# Altium schematic sheet Level_Shifters.SchDoc: Audio Research: Level Shifters
size A4; DrawnBy: Connor Dack; Engineer: Connor Dack; DocumentNumber: 6; Revision: 1.0; SheetNumber: 6; SheetTotal: 20
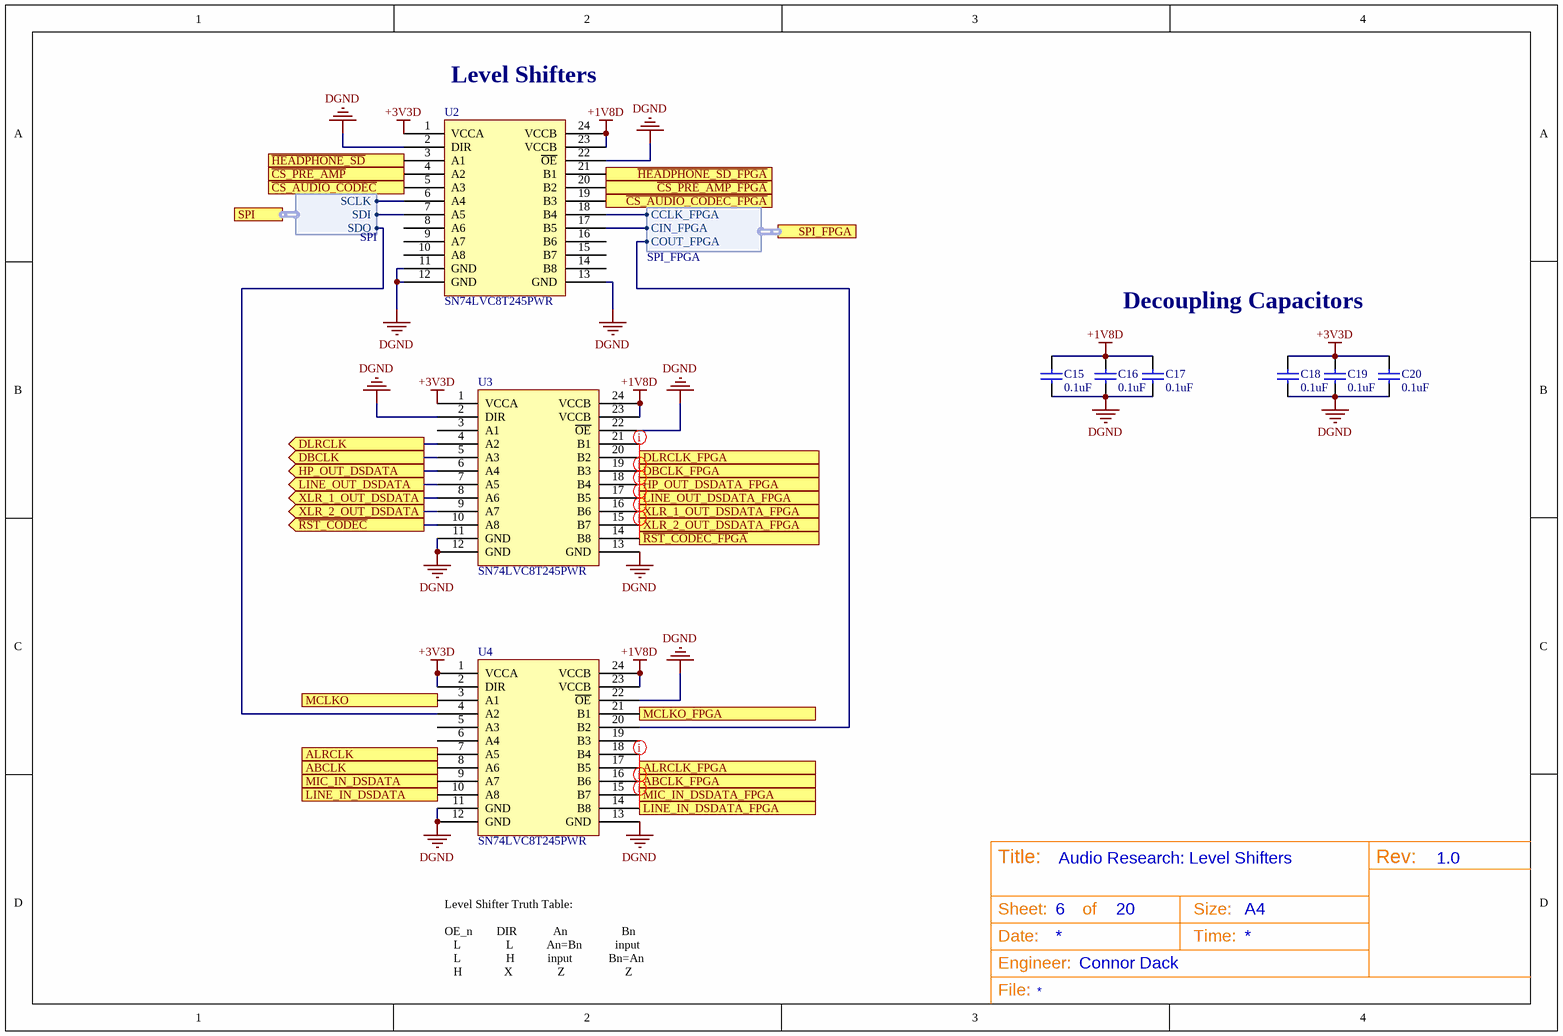
[diagram p0: Level_Shifters.SchDoc]

## Parts
C15  Capacitance: 0.1uF  [3-0603_L]  (hidden comment: CL10F104ZO8NNNC)
C16  Capacitance: 0.1uF  [3-0603_L]  (hidden comment: CL10F104ZO8NNNC)
C17  Capacitance: 0.1uF  [3-0603_L]  (hidden comment: CL10F104ZO8NNNC)
C18  Capacitance: 0.1uF  [3-0603_L]  (hidden comment: CL10F104ZO8NNNC)
C19  Capacitance: 0.1uF  [3-0603_L]  (hidden comment: CL10F104ZO8NNNC)
C20  Capacitance: 0.1uF  [3-0603_L]  (hidden comment: CL10F104ZO8NNNC)
U2  IC BUS TRANSCVR 8BIT 24TSSOP  [TSOP65P640X120-24N]  (value not drawn)
U3  IC BUS TRANSCVR 8BIT 24TSSOP  [TSOP65P640X120-24N]  (value not drawn)
U4  IC BUS TRANSCVR 8BIT 24TSSOP  [TSOP65P640X120-24N]  (value not drawn)

## Ports
ABCLK (in), ABCLK_FPGA (out), ALRCLK (in), ALRCLK_FPGA (out), DBCLK (out), DBCLK_FPGA (in), DLRCLK (out), DLRCLK_FPGA (in), HP_OUT_DSDATA (out), HP_OUT_DSDATA_FPGA (in), LINE_IN_DSDATA (in), LINE_IN_DSDATA_FPGA (out), LINE_OUT_DSDATA (out), LINE_OUT_DSDATA_FPGA (in), MCLKO (in), MCLKO_FPGA (out), MIC_IN_DSDATA (in), MIC_IN_DSDATA_FPGA (out), SPI (harness SPI), SPI_FPGA (harness SPI_FPGA), XLR_1_OUT_DSDATA (out), XLR_1_OUT_DSDATA_FPGA (in), XLR_2_OUT_DSDATA (out), XLR_2_OUT_DSDATA_FPGA (in), ~{CS_AUDIO_CODEC_FPGA} (in), ~{CS_AUDIO_CODEC} (out), ~{CS_PRE_AMP_FPGA} (in), ~{CS_PRE_AMP} (out), ~{HEADPHONE_SD_FPGA} (in), ~{HEADPHONE_SD} (out), ~{RST_CODEC_FPGA} (in), ~{RST_CODEC} (out)

## Harnesses
SPI_FPGA: CIN_FPGA, COUT_FPGA, CCLK_FPGA
SPI: SDI, SCLK, SDO

## Nets
+1V8D: C15.1 C16.1 C17.1 U2.23(VCCB) U2.24(VCCB) U3.23(VCCB) U3.24(VCCB) U4.23(VCCB) U4.24(VCCB)
+3V3D: C18.1 C19.1 C20.1 U2.1(VCCA) U3.1(VCCA) U4.1(VCCA) U4.2(DIR)
DGND: C15.2 C16.2 C17.2 C18.2 C19.2 C20.2 U2.2(DIR) U2.11(GND) U2.12(GND) U2.13(GND) U2.22(~{OE}) U3.2(DIR) U3.11(GND) U3.12(GND) U3.13(GND) U3.22(~{OE}) U4.11(GND) U4.12(GND) U4.13(GND) U4.22(~{OE})
~{RST_CODEC}: U3.10(A8) ; port ~{RST_CODEC}
~{RST_CODEC_FPGA}: U3.14(B8) ; port ~{RST_CODEC_FPGA}
ABCLK: U4.8(A6) ; port ABCLK
ABCLK_FPGA: U4.16(B6) ; port ABCLK_FPGA
ALRCLK: U4.7(A5) ; port ALRCLK
ALRCLK_FPGA: U4.17(B5) ; port ALRCLK_FPGA
~{CS_AUDIO_CODEC}: U2.5(A3) ; port ~{CS_AUDIO_CODEC}
~{CS_AUDIO_CODEC_FPGA}: U2.19(B3) ; port ~{CS_AUDIO_CODEC_FPGA}
~{CS_PRE_AMP}: U2.4(A2) ; port ~{CS_PRE_AMP}
~{CS_PRE_AMP_FPGA}: U2.20(B2) ; port ~{CS_PRE_AMP_FPGA}
DBCLK: U3.5(A3) ; port DBCLK
DBCLK_FPGA: U3.19(B3) ; port DBCLK_FPGA
DLRCLK: U3.4(A2) ; port DLRCLK
DLRCLK_FPGA: U3.20(B2) ; port DLRCLK_FPGA
~{HEADPHONE_SD}: U2.3(A1) ; port ~{HEADPHONE_SD}
~{HEADPHONE_SD_FPGA}: U2.21(B1) ; port ~{HEADPHONE_SD_FPGA}
HP_OUT_DSDATA: U3.6(A4) ; port HP_OUT_DSDATA
HP_OUT_DSDATA_FPGA: U3.18(B4) ; port HP_OUT_DSDATA_FPGA
LINE_IN_DSDATA: U4.10(A8) ; port LINE_IN_DSDATA
LINE_IN_DSDATA_FPGA: U4.14(B8) ; port LINE_IN_DSDATA_FPGA
LINE_OUT_DSDATA: U3.7(A5) ; port LINE_OUT_DSDATA
LINE_OUT_DSDATA_FPGA: U3.17(B5) ; port LINE_OUT_DSDATA_FPGA
MCLKO: U4.3(A1) ; port MCLKO
MCLKO_FPGA: U4.21(B1) ; port MCLKO_FPGA
MIC_IN_DSDATA: U4.9(A7) ; port MIC_IN_DSDATA
MIC_IN_DSDATA_FPGA: U4.15(B7) ; port MIC_IN_DSDATA_FPGA
XLR_1_OUT_DSDATA: U3.8(A6) ; port XLR_1_OUT_DSDATA
XLR_1_OUT_DSDATA_FPGA: U3.16(B6) ; port XLR_1_OUT_DSDATA_FPGA
XLR_2_OUT_DSDATA: U3.9(A7) ; port XLR_2_OUT_DSDATA
XLR_2_OUT_DSDATA_FPGA: U3.15(B7) ; port XLR_2_OUT_DSDATA_FPGA
NetU2_6: U2.6(A4) ; port SPI.SCLK
NetU2_7: U2.7(A5) ; port SPI.SDI
NetU2_17: U2.17(B5) ; port SPI_FPGA.CIN_FPGA
NetU2_18: U2.18(B4) ; port SPI_FPGA.CCLK_FPGA
NetU4_4: U4.4(A2) ; port SPI.SDO
NetU4_20: U4.20(B2) ; port SPI_FPGA.COUT_FPGA

Not connected (* = marked no-connect by the designer): U2 8(A6) 9(A7) 10(A8) 14(B8) 15(B7) 16(B6); U3 3(A1) 21(B1); U4 5(A3) 6(A4) 18(B4) 19(B3)

## Layout directives
net class 1V8_Audio_In: ALRCLK_FPGA, LINE_IN_DSDATA_FPGA, MIC_IN_DSDATA_FPGA
net class 1V8_Audio_Out: DLRCLK_FPGA, HP_OUT_DSDATA_FPGA, LINE_OUT_DSDATA_FPGA, XLR_1_OUT_DSDATA_FPGA, XLR_2_OUT_DSDATA_FPGA, ~{RST_CODEC_FPGA}

## Notes on the sheet
- (near U2) Level Shifters
- Decoupling Capacitors
- Level Shifter Truth Table:
  OE_n        DIR            An                  Bn
  L               L           An=Bn           input
  L               H           input            Bn=An
  H              X               Z                    Z
- Title:
- Sheet:
- of
- Size:
- A4
- Rev:
- Date:
- Engineer:
- Time:
- File:

## Library data of the parts
C15-C20 = CL10F104ZO8NNNC: CAP CER 0.1UF 16V Y5V 0603; Manufacturer: Samsung; Tolerance: 80%; Supplier 1: Digi-Key; Stock 1: 40000; Pricing 1: 1=0.1, 10=0.038, 100=0.0169, 500=0.01208, 1000=0.00949 (USD); Mount: Surface Mount; Case/Package: 0603; Case Code (Metric): 1608; Case Code (Imperial): 0603; Min Operating Temperature: -30°C; Max Operating Temperature: 85°C; Package Quantity: 1; Packaging: Tape and Reel; Voltage Rating: 16V; Dielectric: Y5V; Length: 1.6mm; Height: 0.8mm; Width: 0.031inch; Thickness: 0.035inch; Depth: 0.8mm; Radiation Hardening: No; ComponentLink1URL: https://datasheet.ciiva.com/25805/cl10f104zo8nnnc-25805810.pdf; ComponentLink1Description: https://datasheet.ciiva.com/25805/cl10f104zo8nnnc-25805810.pdf; ComponentLink2URL: https://datasheet.ciiva.com/16199/cl10f104zo8nnnc-16199254.pdf; ComponentLink2Description: https://datasheet.ciiva.com/16199/cl10f104zo8nnnc-16199254.pdf; Supplier Part Number 1: 1276-1258-6-ND; Manufacturer Part Number: CL10F104ZO8NNNC
U2-U4 = SN74LVC8T245PWR: Voltage Level Translator Bidirectional 1 Circuit 8 Channel 24-TSSOP; Manufacturer: Texas Instruments; Number of Channels: 8; Propagation Delay: 4.2ns; Number of Elements: 1; Min Supply Voltage: 1.65V; Max Supply Voltage: 5.5V; Operating Supply Voltage: 3.3V; Data Rate: 500Mbps; Logic Function: Transceiver,Translator; High Level Output Current: -32mA; Low Level Output Current: 32mA; Polarity: Non-Inverting; Turn-On Delay Time: 32.2ns; Quiescent Current: 15uA; ComponentLink1URL: https://datasheet.ciiva.com/1899/sn74lvc8t245-1899395.pdf; ComponentLink1Description: https://datasheet.ciiva.com/1899/sn74lvc8t245-1899395.pdf; ComponentLink2URL: https://datasheet.ciiva.com/34301/1048559-34301923.pdf; ComponentLink2Description: https://datasheet.ciiva.com/34301/1048559-34301923.pdf; ComponentLink3URL: https://datasheet.ciiva.com/1899/sn74lvc8t245-1899396.pdf; ComponentLink3Description: https://datasheet.ciiva.com/1899/sn74lvc8t245-1899396.pdf; ComponentLink4URL: https://datasheet.ciiva.com/1899/sn74lvc8t245-1899397.pdf; ComponentLink4Description: https://datasheet.ciiva.com/1899/sn74lvc8t245-1899397.pdf; ComponentLink5URL: https://datasheet.ciiva.com/7795/1763937-7795013.pdf; ComponentLink5Description: https://datasheet.ciiva.com/7795/1763937-7795013.pdf; ComponentLink6URL: https://datasheet.ciiva.com/15086/getdatasheetpartid-48801-15086005.pdf; ComponentLink6Description: https://datasheet.ciiva.com/15086/getdatasheetpartid-48801-15086005.pdf; ComponentLink7URL: https://datasheet.ciiva.com/25973/sn74lvc8t245-25973803.pdf; ComponentLink7Description: https://datasheet.ciiva.com/25973/sn74lvc8t245-25973803.pdf; ComponentLink8URL: https://datasheet.ciiva.com/46439/1831204-46439647.pdf; ComponentLink8Description: https://datasheet.ciiva.com/46439/1831204-46439647.pdf; ComponentLink9URL: https://datasheet.ciiva.com/26867/sn74lvc8t245pwr-26867745.pdf; ComponentLink9Description: https://datasheet.ciiva.com/26867/sn74lvc8t245pwr-26867745.pdf; ComponentLink10URL: https://datasheet.ciiva.com/41455/001017232-da-01-en-ic-bus-8bit-sn74lvc8t245pwr-tssop-24-tid-41455868.pdf; ComponentLink10Description: https://datasheet.ciiva.com/41455/001017232-da-01-en-ic-bus-8bit-sn74lvc8t245pwr-tssop-24-tid-41455868.pdf; Supplier 1: Digi-Key; Stock 1: 119243; Pricing 1: 1=1.05, 10=0.936, 100=0.7297, 500=0.6028, 1000=0.4759 (USD); Mount: Surface Mount; Case/Package: TSSOP; Number of Pins: 24; Weight: 0.003157oz; Contact Plating: Gold; Min Operating Temperature: -40°C; Max Operating Temperature: 85°C; Package Quantity: 1; Packaging: Tape and Reel; Direction: Bidirectional; Number of Bits: 8; Number of Outputs: 8; Length: 7.9mm; Height: 1.05mm; Width: 4.5mm; Radiation Hardening: No; REACH SVHC: No SVHC; Lead Free: Lead Free; Supplier Part Number 1: 296-18593-6-ND; Manufacturer Part Number: SN74LVC8T245PWR